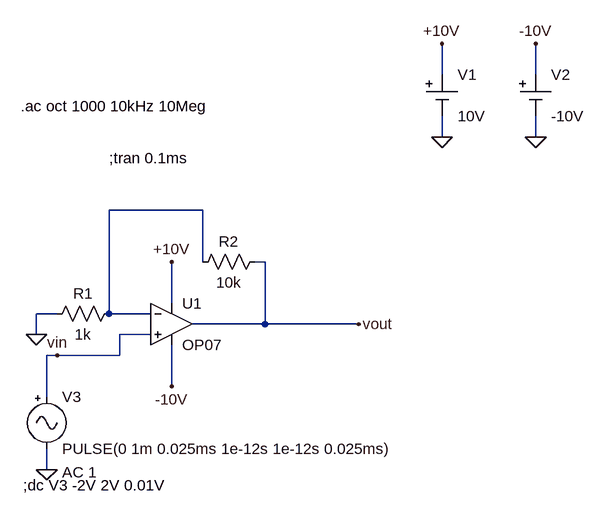
[diagram p0: schematic Lab 1 frequency domain.asc]
Lab 1 frequency domain.asc, the LTspice schematic file:
Version 4
SHEET 1 880 680
WIRE 656 -208 656 -256
WIRE 800 -208 800 -256
WIRE 656 -112 656 -144
WIRE 800 -112 800 -144
WIRE 288 0 144 0
WIRE 288 80 288 0
WIRE 384 80 368 80
WIRE 240 144 240 80
WIRE 64 160 32 160
WIRE 144 160 144 0
WIRE 208 160 144 160
WIRE 384 176 384 80
WIRE 384 176 272 176
WIRE 528 176 384 176
WIRE 32 192 32 160
WIRE 208 192 160 192
WIRE 64 224 48 224
WIRE 160 224 160 192
WIRE 160 224 64 224
WIRE 240 272 240 208
WIRE 48 288 48 224
WIRE 48 400 48 368
FLAG 656 -112 0
FLAG 800 -112 0
FLAG 656 -256 +10V
FLAG 800 -256 -10V
FLAG 240 80 +10V
FLAG 240 272 -10V
FLAG 32 192 0
FLAG 48 400 0
FLAG 528 176 vout
FLAG 64 224 vin
SYMBOL Opamps\\OP07 240 112 R0
SYMATTR InstName U1
SYMBOL Misc\\cell 656 -208 R0
WINDOW 123 0 0 Left 0
WINDOW 39 0 0 Left 0
SYMATTR InstName V1
SYMATTR Value 10V
SYMBOL Misc\\cell 800 -208 R0
WINDOW 123 0 0 Left 0
WINDOW 39 0 0 Left 0
SYMATTR InstName V2
SYMATTR Value -10V
SYMBOL res 160 144 R90
WINDOW 0 0 56 VBottom 2
WINDOW 3 32 56 VTop 2
SYMATTR InstName R1
SYMATTR Value 1k
SYMBOL res 384 64 R90
WINDOW 0 0 56 VBottom 2
WINDOW 3 32 56 VTop 2
SYMATTR InstName R2
SYMATTR Value 10k
SYMBOL Misc\\signal 48 272 R0
WINDOW 123 24 132 Left 2
WINDOW 39 0 0 Left 0
SYMATTR InstName V3
SYMATTR Value PULSE(0 1m 0.025ms 1e-12s 1e-12s 0.025ms)
SYMATTR Value2 AC 1
TEXT 12 424 Left 2 !;dc V3 -2V 2V 0.01V
TEXT 144 -80 Left 2 !;tran 0.1ms
TEXT 8 -160 Left 2 !.ac oct 1000 10kHz 10Meg

The netlist it stands for:
* Lab 1 frequency domain.asc
XU1 vin N001 +10V -10V vout LT1001  ; OP07, pins In+ In- V+ V- OUT
V1 +10V 0 10V
V2 -10V 0 -10V
R1 N001 0 1k
R2 vout N001 10k
V3 vin 0 PULSE(0 1m 0.025ms 1e-12s 1e-12s 0.025ms) AC 1
;dc V3 -2V 2V 0.01V
;tran 0.1ms
.ac oct 1000 10kHz 10Meg
.lib LTC.lib
.backanno
.end